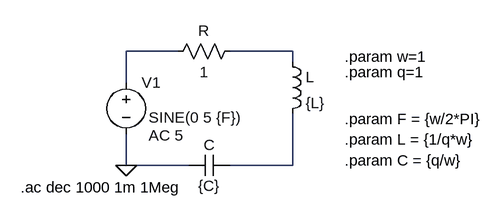
[diagram p0: schematic Circuito RLC en serie.asc]
Circuito RLC en serie.asc, the LTspice schematic file:
Version 4
SHEET 1 880 680
WIRE 144 96 64 96
WIRE 320 96 224 96
WIRE 320 112 320 96
WIRE 64 144 64 96
WIRE 64 272 64 224
WIRE 160 272 64 272
WIRE 320 272 320 192
WIRE 320 272 224 272
FLAG 64 272 0
SYMBOL res 240 80 R90
WINDOW 0 0 56 VBottom 2
WINDOW 3 32 56 VTop 2
SYMATTR InstName R
SYMATTR Value 1
SYMBOL ind 304 96 R0
SYMATTR InstName L
SYMATTR Value {L}
SYMBOL cap 224 256 R90
WINDOW 0 0 32 VBottom 2
WINDOW 3 32 32 VTop 2
SYMATTR InstName C
SYMATTR Value {C}
SYMBOL voltage 64 128 R0
WINDOW 3 35 70 Left 2
WINDOW 123 35 98 Left 2
WINDOW 39 0 0 Left 0
SYMATTR InstName V1
SYMATTR Value SINE(0 5 {F})
SYMATTR Value2 AC 5
TEXT 400 264 Left 2 !.param C = {q/w}
TEXT 400 232 Left 2 !.param L = {1/q*w}
TEXT 400 200 Left 2 !.param F = {w/2*PI}
TEXT 400 104 Left 2 !.param w=1
TEXT 400 128 Left 2 !.param q=1
TEXT -98 306 Left 2 !.ac dec 1000 1m 1Meg

The netlist it stands for:
* Circuito RLC en serie.asc
R N002 N001 1
L N002 N003 {L}
C N003 0 {C}
V1 N001 0 SINE(0 5 {F}) AC 5
.param C = {q/w}
.param L = {1/q*w}
.param F = {w/2*PI}
.param w=1
.param q=1
.ac dec 1000 1m 1Meg
.backanno
.end